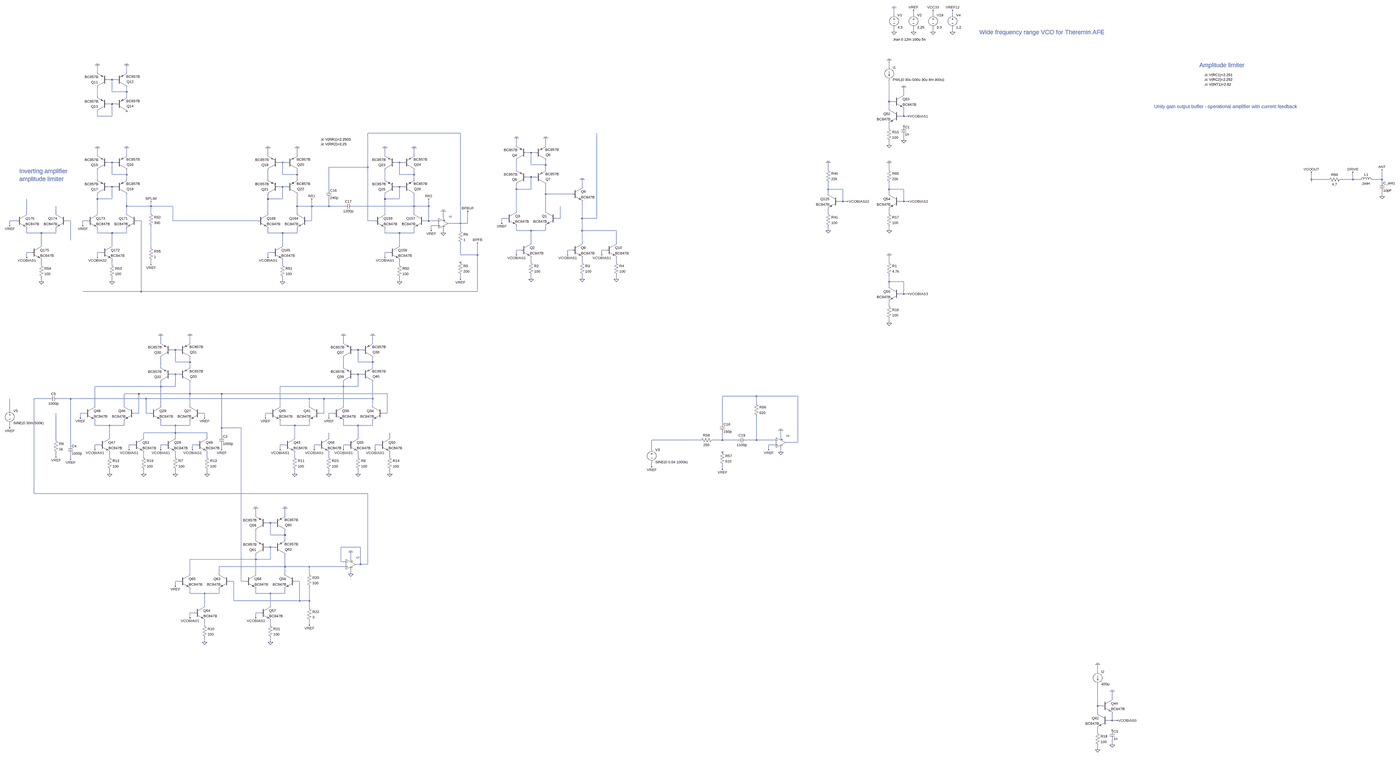
[diagram p0: schematic vco_sine_bjt_v11.asc, whole sheet]
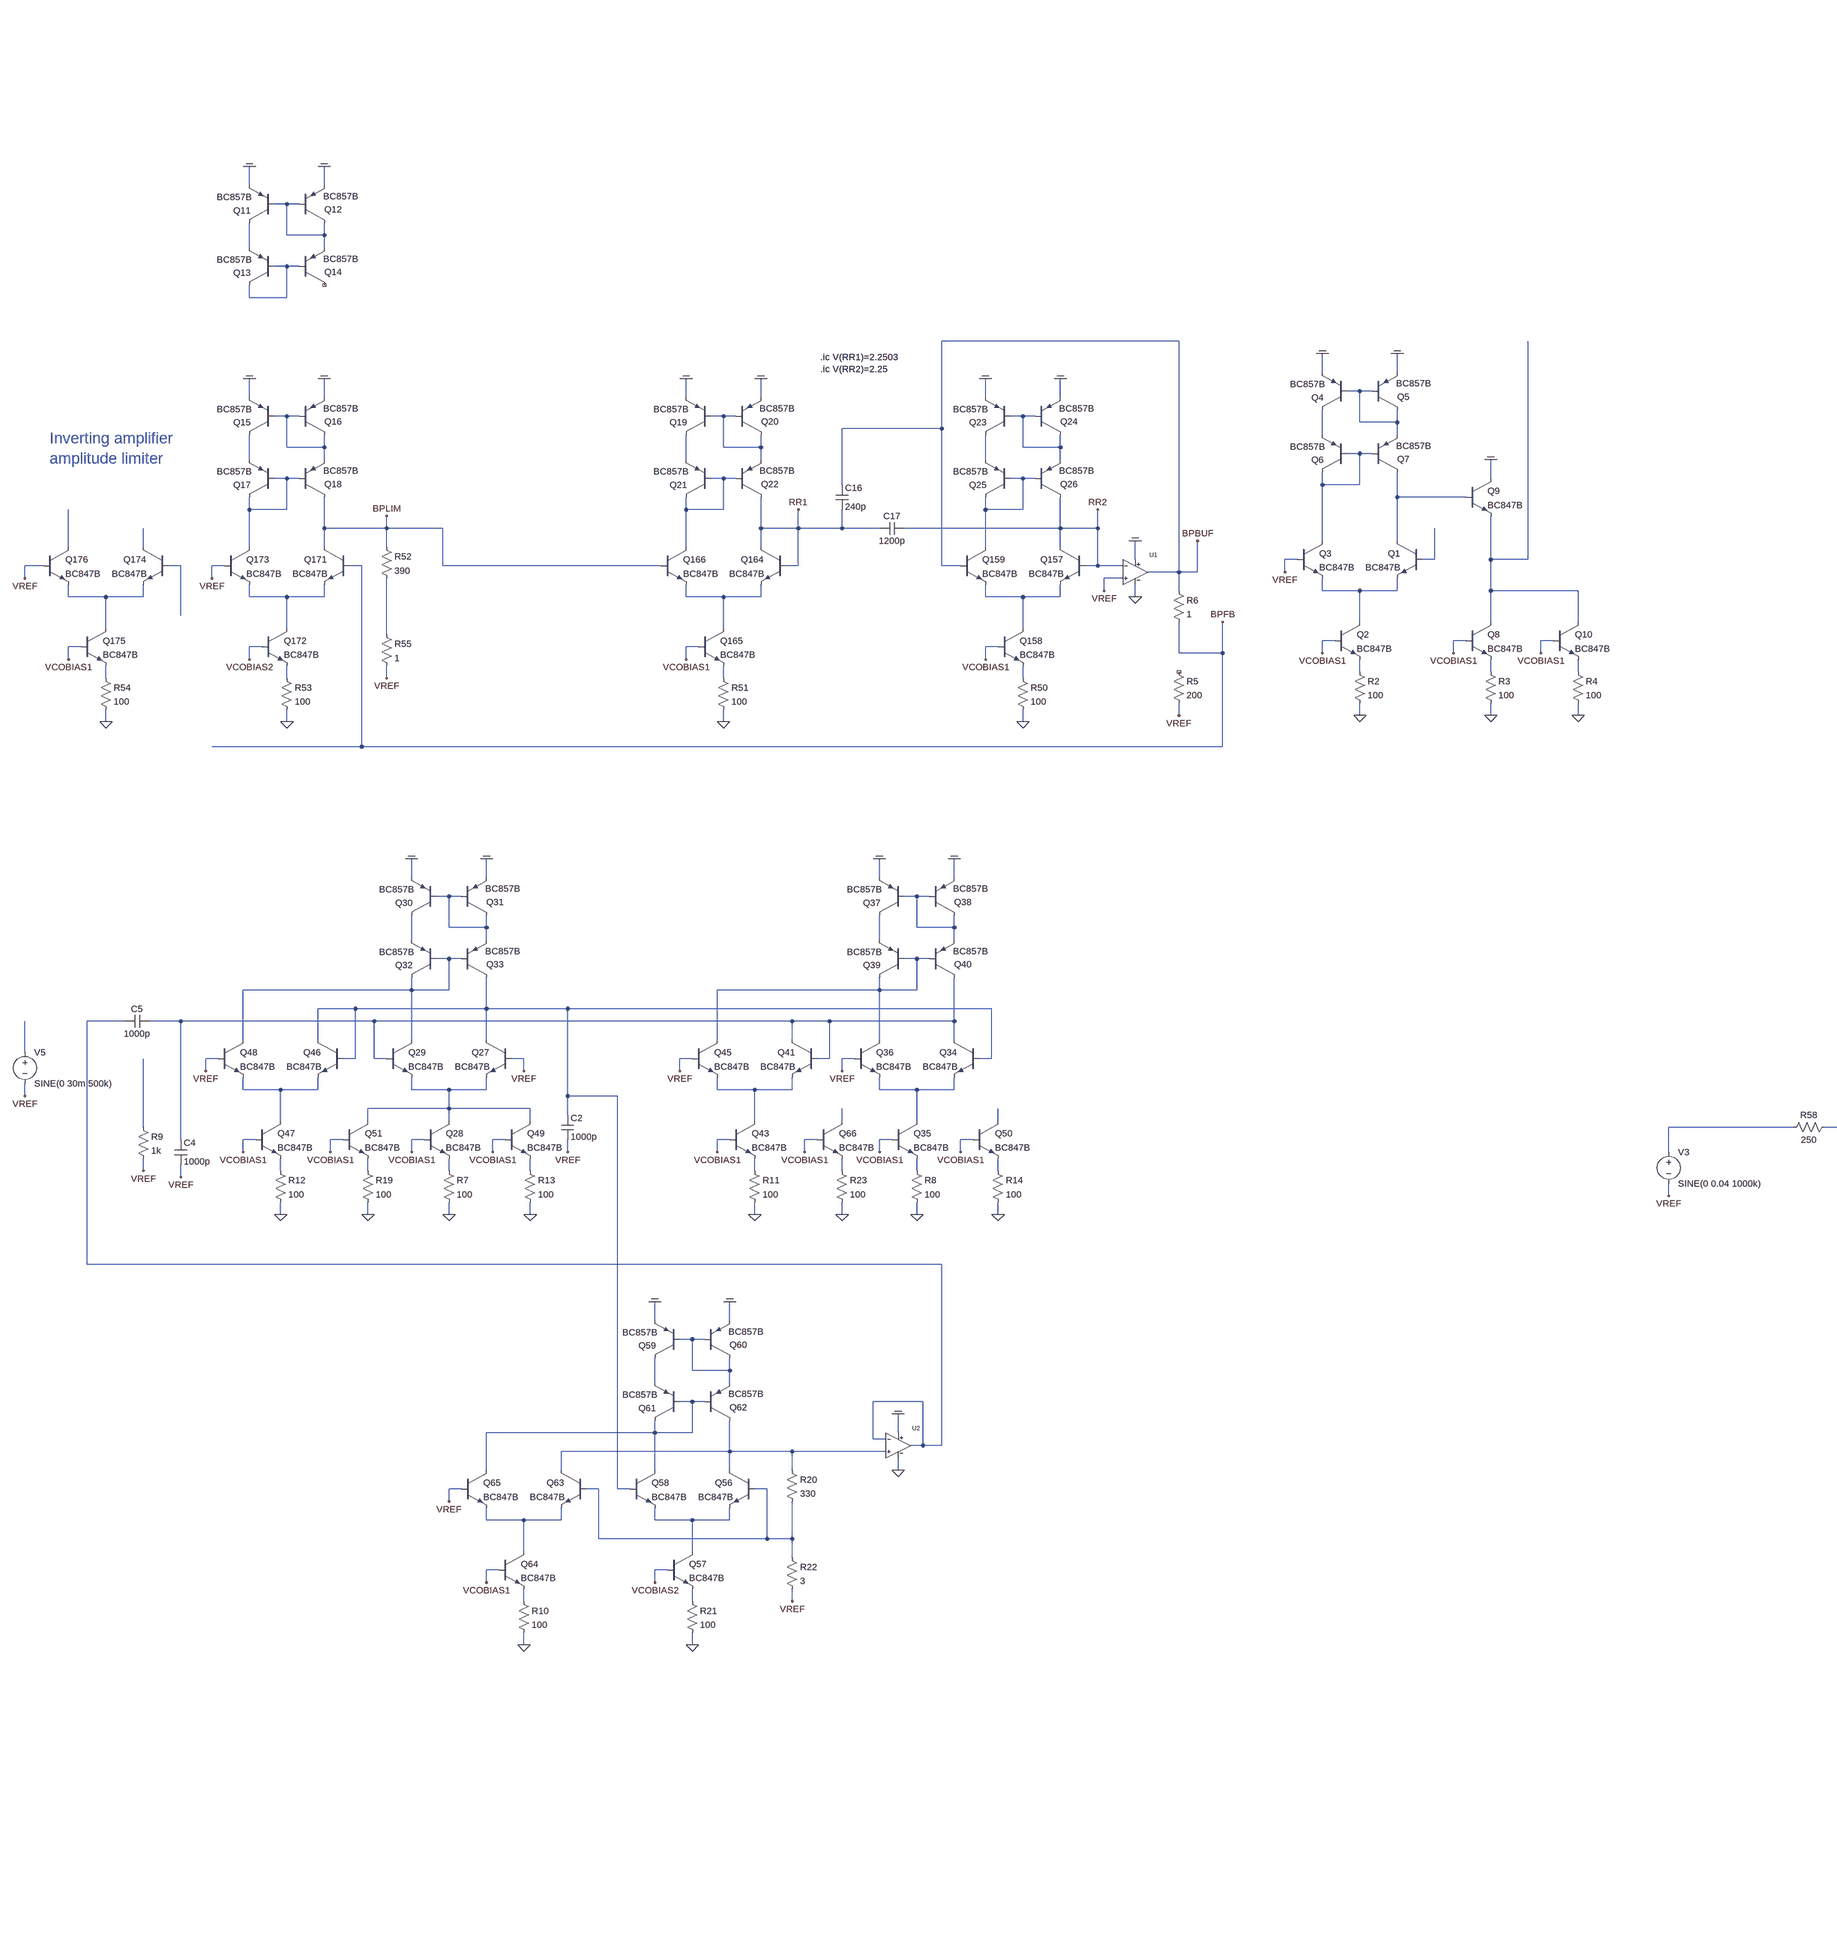
[diagram p1: schematic vco_sine_bjt_v11.asc, part, row 1 of 1, column 1 of 2]
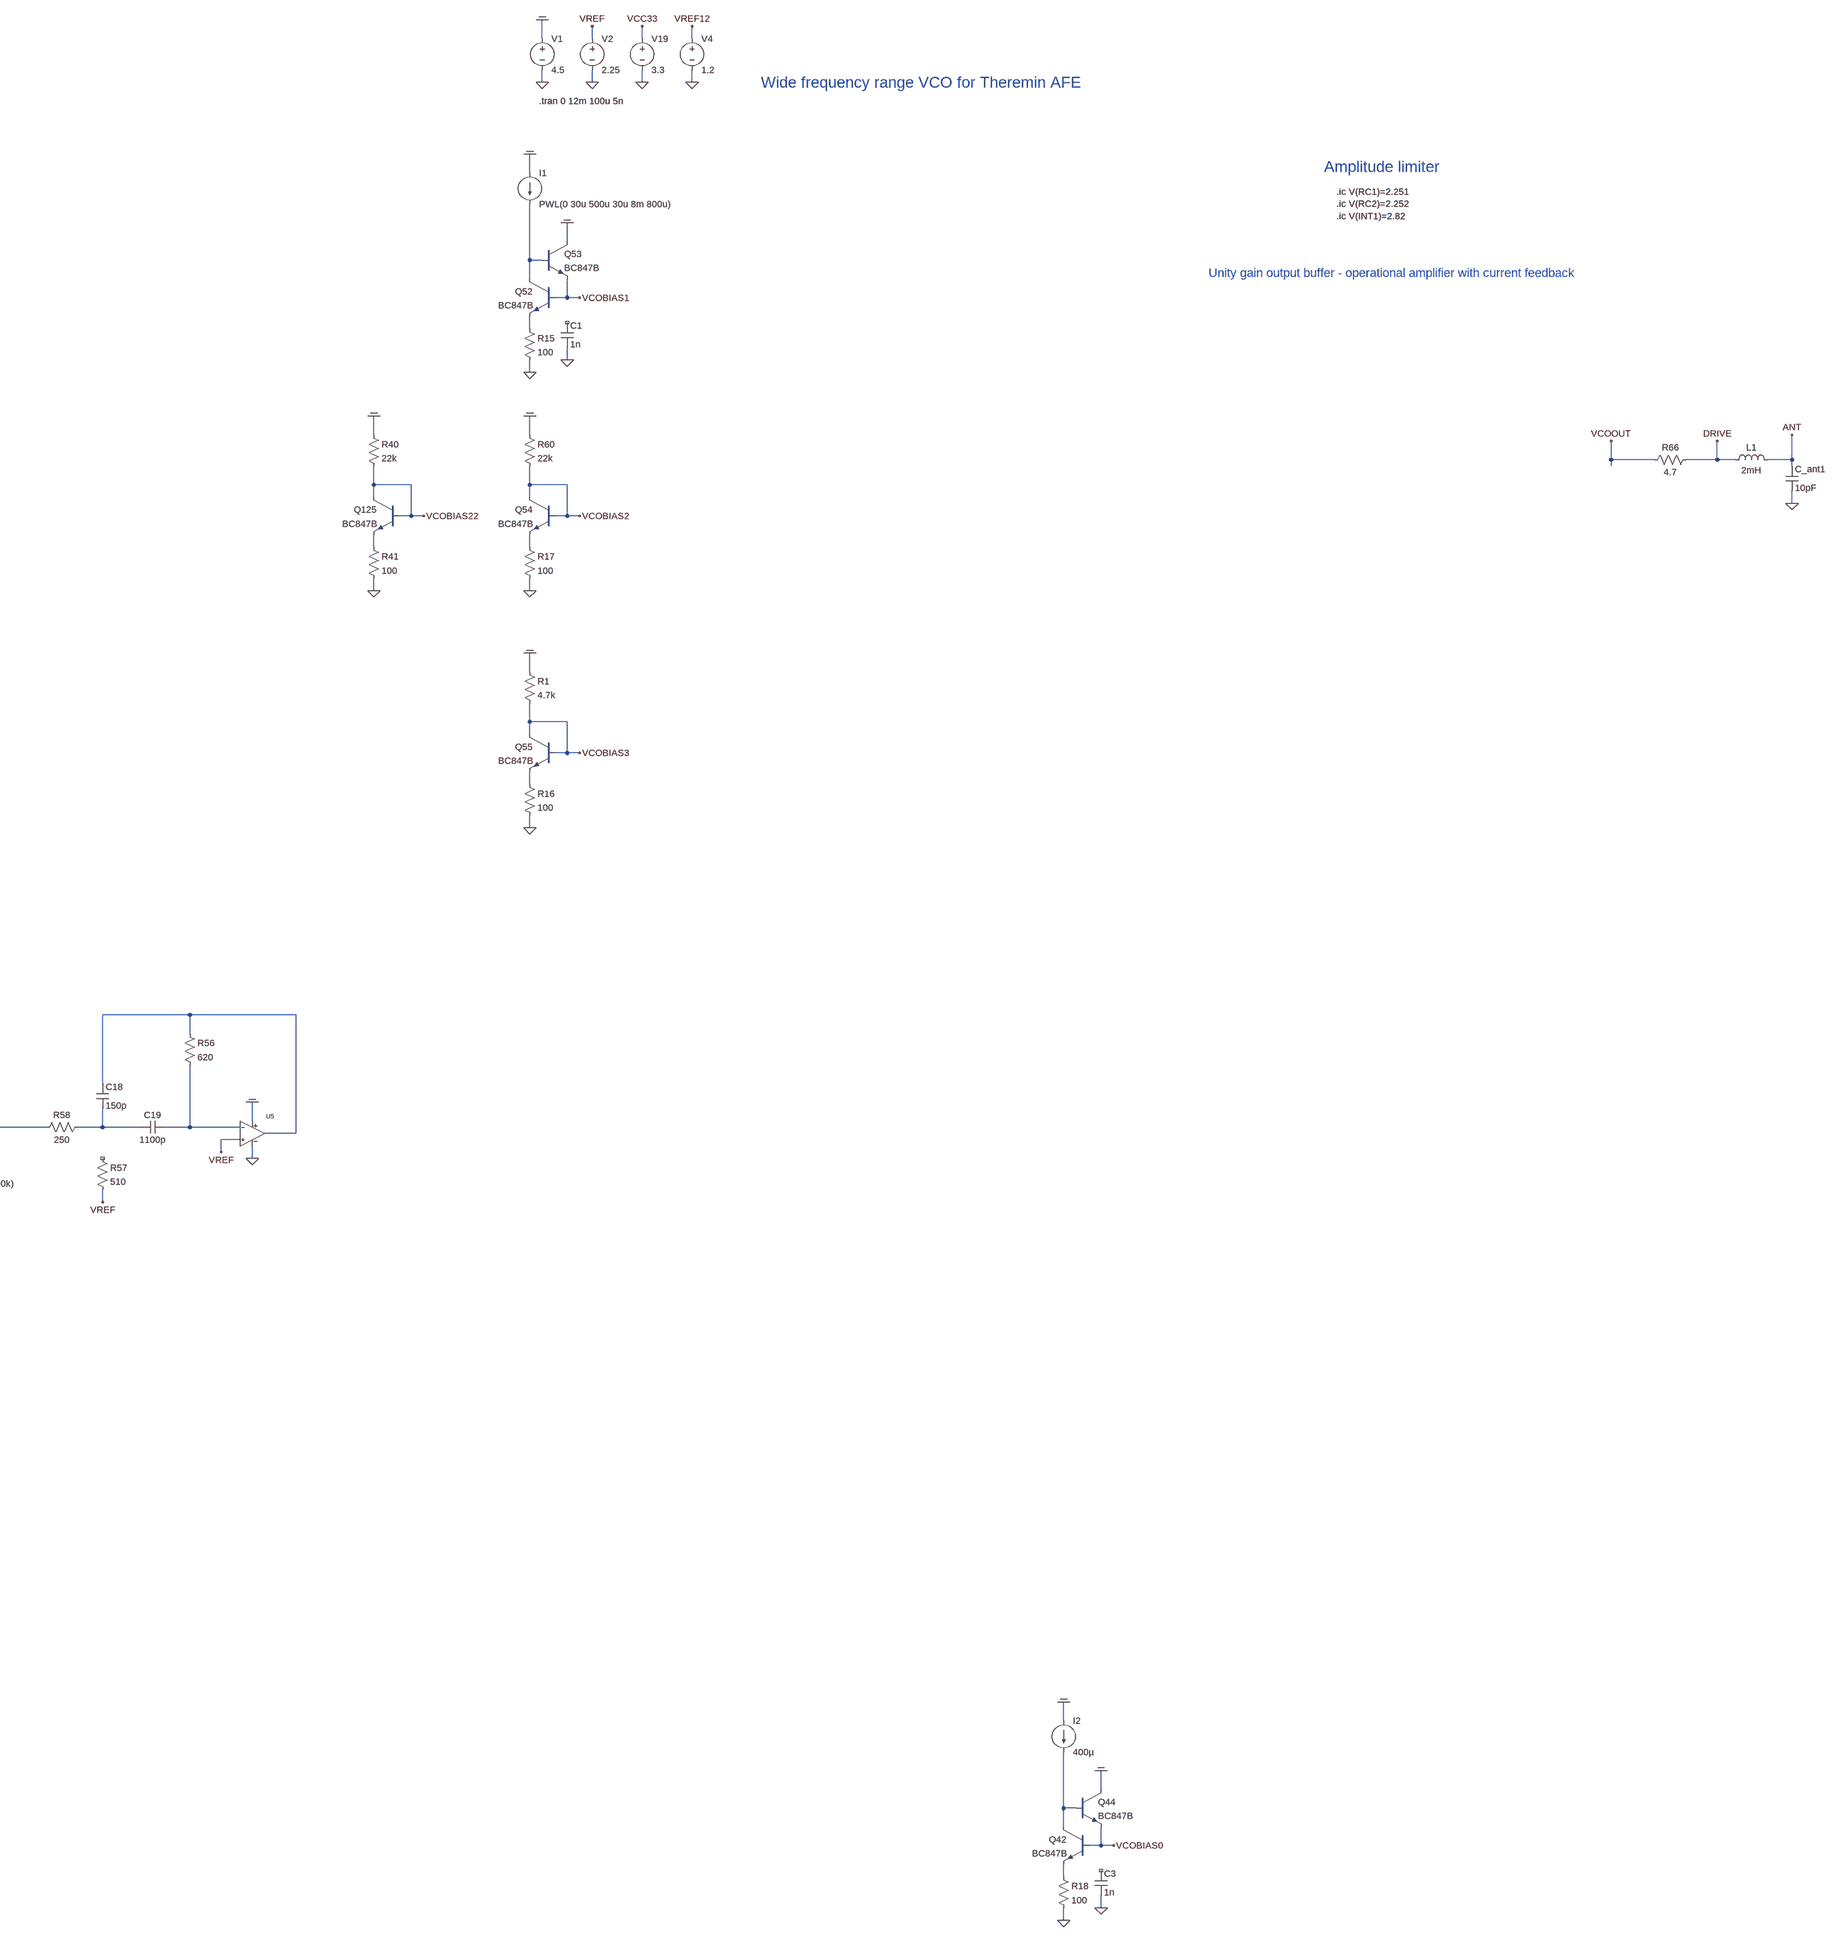
[diagram p2: schematic vco_sine_bjt_v11.asc, part, row 1 of 1, column 2 of 2]
vco_sine_bjt_v11.asc, the LTspice schematic file:
Version 4
SHEET 1 13504 21184
WIRE -432 13600 -432 13552
WIRE -304 13600 -304 13568
WIRE -176 13600 -176 13568
WIRE -48 13600 -48 13568
WIRE -432 13712 -432 13680
WIRE -304 13712 -304 13680
WIRE -176 13712 -176 13680
WIRE -48 13712 -48 13680
WIRE -464 14000 -464 13952
WIRE -6208 14032 -6208 13984
WIRE -6016 14032 -6016 13984
WIRE -6112 14080 -6144 14080
WIRE -6080 14080 -6112 14080
WIRE -6112 14160 -6112 14080
WIRE -6016 14160 -6016 14128
WIRE -6016 14160 -6112 14160
WIRE -368 14176 -368 14128
WIRE -6208 14192 -6208 14128
WIRE -6016 14192 -6016 14160
WIRE -464 14224 -464 14080
WIRE -432 14224 -464 14224
WIRE -6112 14240 -6144 14240
WIRE -6080 14240 -6112 14240
WIRE -464 14272 -464 14224
WIRE -6208 14320 -6208 14288
WIRE -6112 14320 -6112 14240
WIRE -6112 14320 -6208 14320
WIRE -368 14320 -368 14272
WIRE -368 14320 -400 14320
WIRE -336 14320 -368 14320
WIRE -464 14400 -464 14368
WIRE -3824 14432 -4432 14432
WIRE -368 14480 -368 14448
WIRE -3456 14512 -3456 14464
WIRE -3264 14512 -3264 14464
WIRE -464 14512 -464 14480
WIRE -3360 14560 -3392 14560
WIRE -3328 14560 -3360 14560
WIRE -6208 14576 -6208 14528
WIRE -6016 14576 -6016 14528
WIRE -5088 14576 -5088 14528
WIRE -4896 14576 -4896 14528
WIRE -4320 14576 -4320 14528
WIRE -4128 14576 -4128 14528
WIRE -6112 14624 -6144 14624
WIRE -6080 14624 -6112 14624
WIRE -4992 14624 -5024 14624
WIRE -4960 14624 -4992 14624
WIRE -4224 14624 -4256 14624
WIRE -4192 14624 -4224 14624
WIRE -3360 14640 -3360 14560
WIRE -3264 14640 -3264 14608
WIRE -3264 14640 -3360 14640
WIRE -4432 14656 -4432 14432
WIRE -4432 14656 -4688 14656
WIRE -3456 14672 -3456 14608
WIRE -3264 14672 -3264 14640
WIRE -864 14672 -864 14624
WIRE -464 14672 -464 14624
WIRE -6112 14704 -6112 14624
WIRE -6016 14704 -6016 14672
WIRE -6016 14704 -6112 14704
WIRE -4992 14704 -4992 14624
WIRE -4896 14704 -4896 14672
WIRE -4896 14704 -4992 14704
WIRE -4224 14704 -4224 14624
WIRE -4128 14704 -4128 14672
WIRE -4128 14704 -4224 14704
WIRE -3360 14720 -3392 14720
WIRE -3328 14720 -3360 14720
WIRE -6208 14736 -6208 14672
WIRE -6016 14736 -6016 14704
WIRE -5088 14736 -5088 14672
WIRE -4896 14736 -4896 14704
WIRE -4320 14736 -4320 14672
WIRE -4128 14736 -4128 14704
WIRE 3536 14736 3536 14688
WIRE 3648 14736 3536 14736
WIRE 3808 14736 3808 14688
WIRE 3808 14736 3728 14736
WIRE 3856 14736 3808 14736
WIRE 4000 14736 4000 14672
WIRE 4000 14736 3936 14736
WIRE 3536 14752 3536 14736
WIRE 4000 14752 4000 14736
WIRE -6112 14784 -6144 14784
WIRE -6080 14784 -6112 14784
WIRE -4992 14784 -5024 14784
WIRE -4960 14784 -4992 14784
WIRE -4224 14784 -4256 14784
WIRE -4192 14784 -4224 14784
WIRE -3024 14784 -3024 14736
WIRE -4688 14800 -4688 14656
WIRE -3456 14800 -3456 14768
WIRE -3360 14800 -3360 14720
WIRE -3360 14800 -3456 14800
WIRE -864 14800 -864 14752
WIRE -768 14800 -864 14800
WIRE -464 14800 -464 14752
WIRE -368 14800 -464 14800
WIRE -3264 14832 -3264 14768
WIRE -3088 14832 -3264 14832
WIRE -864 14832 -864 14800
WIRE -464 14832 -464 14800
WIRE 4000 14848 4000 14816
WIRE -6208 14864 -6208 14832
WIRE -6112 14864 -6112 14784
WIRE -6112 14864 -6208 14864
WIRE -5088 14864 -5088 14832
WIRE -4992 14864 -4992 14784
WIRE -4992 14864 -5088 14864
WIRE -4320 14864 -4320 14832
WIRE -4224 14864 -4224 14784
WIRE -4224 14864 -4320 14864
WIRE -768 14880 -768 14800
WIRE -768 14880 -800 14880
WIRE -736 14880 -768 14880
WIRE -368 14880 -368 14800
WIRE -368 14880 -400 14880
WIRE -336 14880 -368 14880
WIRE -6016 14912 -6016 14832
WIRE -5856 14912 -5856 14880
WIRE -5856 14912 -6016 14912
WIRE -5712 14912 -5856 14912
WIRE -4896 14912 -4896 14832
WIRE -4800 14912 -4800 14864
WIRE -4800 14912 -4896 14912
WIRE -4688 14912 -4688 14864
WIRE -4688 14912 -4800 14912
WIRE -4592 14912 -4688 14912
WIRE -4128 14912 -4128 14832
WIRE -4128 14912 -4528 14912
WIRE -4032 14912 -4032 14864
WIRE -4032 14912 -4128 14912
WIRE -3456 14944 -3456 14800
WIRE -3264 14944 -3264 14832
WIRE -6672 14960 -6672 14864
WIRE -6480 14960 -6480 14912
WIRE -6208 14960 -6208 14864
WIRE -6016 14960 -6016 14912
WIRE -5856 14960 -5856 14912
WIRE -5088 14960 -5088 14864
WIRE -4896 14960 -4896 14912
WIRE -4320 14960 -4320 14864
WIRE -4128 14960 -4128 14912
WIRE -864 14960 -864 14928
WIRE -464 14960 -464 14928
WIRE -3936 14992 -3936 14944
WIRE -3520 14992 -3552 14992
WIRE -3168 14992 -3168 14912
WIRE -3168 14992 -3200 14992
WIRE -3024 14992 -3024 14880
WIRE -2928 14992 -2928 14432
WIRE -2928 14992 -3024 14992
WIRE -6736 15008 -6784 15008
WIRE -6384 15008 -6416 15008
WIRE -6272 15008 -6304 15008
WIRE -5920 15008 -5952 15008
WIRE -5712 15008 -5712 14912
WIRE -5152 15008 -5712 15008
WIRE -4800 15008 -4800 14912
WIRE -4800 15008 -4832 15008
WIRE -4432 15008 -4432 14656
WIRE -4384 15008 -4432 15008
WIRE -4032 15008 -4032 14912
WIRE -4032 15008 -4064 15008
WIRE -3968 15008 -4032 15008
WIRE -3824 15024 -3824 14432
WIRE -3824 15024 -3904 15024
WIRE -3776 15024 -3776 14944
WIRE -3776 15024 -3824 15024
WIRE -3552 15024 -3552 14992
WIRE -6784 15040 -6784 15008
WIRE -6304 15040 -6304 15008
WIRE -3968 15040 -4016 15040
WIRE -4016 15072 -4016 15040
WIRE -3824 15072 -3824 15024
WIRE -3456 15072 -3456 15040
WIRE -3360 15072 -3456 15072
WIRE -3264 15072 -3264 15040
WIRE -3264 15072 -3360 15072
WIRE -3024 15072 -3024 14992
WIRE -2800 15072 -3024 15072
WIRE -864 15072 -864 15040
WIRE -464 15072 -464 15040
WIRE -6672 15088 -6672 15056
WIRE -6576 15088 -6672 15088
WIRE -6480 15088 -6480 15056
WIRE -6480 15088 -6576 15088
WIRE -6208 15088 -6208 15056
WIRE -6112 15088 -6208 15088
WIRE -6016 15088 -6016 15056
WIRE -6016 15088 -6112 15088
WIRE -5088 15088 -5088 15056
WIRE -4992 15088 -5088 15088
WIRE -4896 15088 -4896 15056
WIRE -4896 15088 -4992 15088
WIRE -4320 15088 -4320 15056
WIRE -4224 15088 -4320 15088
WIRE -4128 15088 -4128 15056
WIRE -4128 15088 -4224 15088
WIRE -3936 15088 -3936 15056
WIRE -6384 15136 -6384 15008
WIRE -3360 15152 -3360 15072
WIRE -3024 15152 -3024 15072
WIRE -2800 15152 -2800 15072
WIRE -6576 15168 -6576 15088
WIRE -6112 15168 -6112 15088
WIRE -4992 15168 -4992 15088
WIRE -4224 15168 -4224 15088
WIRE -5856 15184 -5856 15040
WIRE -3424 15200 -3456 15200
WIRE -3088 15200 -3120 15200
WIRE -2864 15200 -2896 15200
WIRE -6640 15216 -6672 15216
WIRE -6176 15216 -6208 15216
WIRE -5056 15216 -5088 15216
WIRE -4288 15216 -4320 15216
WIRE -3824 15232 -3824 15152
WIRE -3712 15232 -3712 15152
WIRE -3712 15232 -3824 15232
WIRE -3456 15232 -3456 15200
WIRE -3120 15232 -3120 15200
WIRE -2896 15232 -2896 15200
WIRE -6672 15248 -6672 15216
WIRE -6208 15248 -6208 15216
WIRE -5088 15248 -5088 15216
WIRE -4320 15248 -4320 15216
WIRE -3360 15280 -3360 15248
WIRE -3024 15280 -3024 15248
WIRE -2800 15280 -2800 15248
WIRE -464 15280 -464 15232
WIRE -6576 15296 -6576 15264
WIRE -6112 15296 -6112 15264
WIRE -5856 15296 -5856 15264
WIRE -4992 15296 -4992 15264
WIRE -4224 15296 -4224 15264
WIRE -3824 15392 -3824 15360
WIRE -3360 15392 -3360 15360
WIRE -3024 15392 -3024 15360
WIRE -2800 15392 -2800 15360
WIRE -6576 15408 -6576 15376
WIRE -6112 15408 -6112 15376
WIRE -4992 15408 -4992 15376
WIRE -4224 15408 -4224 15376
WIRE -464 15408 -464 15360
WIRE -368 15408 -464 15408
WIRE -464 15440 -464 15408
WIRE -5920 15472 -5920 15008
WIRE -5920 15472 -6304 15472
WIRE -3712 15472 -3712 15232
WIRE -3712 15472 -5920 15472
WIRE -368 15488 -368 15408
WIRE -368 15488 -400 15488
WIRE -336 15488 -368 15488
WIRE -464 15568 -464 15536
WIRE -464 15680 -464 15648
WIRE -5792 15808 -5792 15760
WIRE -5600 15808 -5600 15760
WIRE -4592 15808 -4592 15760
WIRE -4400 15808 -4400 15760
WIRE -5696 15856 -5728 15856
WIRE -5664 15856 -5696 15856
WIRE -4496 15856 -4528 15856
WIRE -4464 15856 -4496 15856
WIRE -5696 15936 -5696 15856
WIRE -5600 15936 -5600 15904
WIRE -5600 15936 -5696 15936
WIRE -4496 15936 -4496 15856
WIRE -4400 15936 -4400 15904
WIRE -4400 15936 -4496 15936
WIRE -5792 15968 -5792 15904
WIRE -5600 15968 -5600 15936
WIRE -4592 15968 -4592 15904
WIRE -4400 15968 -4400 15936
WIRE -5696 16016 -5728 16016
WIRE -5664 16016 -5696 16016
WIRE -4496 16016 -4528 16016
WIRE -4464 16016 -4496 16016
WIRE -5792 16096 -5792 16064
WIRE -5792 16096 -6224 16096
WIRE -5696 16096 -5696 16016
WIRE -5696 16096 -5792 16096
WIRE -4592 16096 -4592 16064
WIRE -4592 16096 -5008 16096
WIRE -4496 16096 -4496 16016
WIRE -4496 16096 -4592 16096
WIRE -5936 16144 -6032 16144
WIRE -5600 16144 -5600 16064
WIRE -5600 16144 -5936 16144
WIRE -5392 16144 -5600 16144
WIRE -4304 16144 -5392 16144
WIRE -1776 16160 -2000 16160
WIRE -1504 16160 -1776 16160
WIRE -6528 16176 -6624 16176
WIRE -6384 16176 -6464 16176
WIRE -5888 16176 -6384 16176
WIRE -4816 16176 -5888 16176
WIRE -4720 16176 -4816 16176
WIRE -4400 16176 -4400 16064
WIRE -4400 16176 -4720 16176
WIRE -1776 16208 -1776 16160
WIRE -6224 16224 -6224 16096
WIRE -6032 16224 -6032 16144
WIRE -5792 16224 -5792 16096
WIRE -5600 16224 -5600 16144
WIRE -5008 16224 -5008 16096
WIRE -4816 16224 -4816 16176
WIRE -4592 16224 -4592 16096
WIRE -4400 16224 -4400 16176
WIRE -6784 16256 -6784 16176
WIRE -6288 16272 -6320 16272
WIRE -5936 16272 -5936 16144
WIRE -5936 16272 -5968 16272
WIRE -5888 16272 -5888 16176
WIRE -5856 16272 -5888 16272
WIRE -5504 16272 -5536 16272
WIRE -5072 16272 -5104 16272
WIRE -4720 16272 -4720 16176
WIRE -4720 16272 -4752 16272
WIRE -4656 16272 -4688 16272
WIRE -4304 16272 -4304 16144
WIRE -4304 16272 -4336 16272
WIRE -6320 16304 -6320 16272
WIRE -5504 16304 -5504 16272
WIRE -5104 16304 -5104 16272
WIRE -4688 16304 -4688 16272
WIRE -2000 16336 -2000 16160
WIRE -6224 16352 -6224 16320
WIRE -6128 16352 -6224 16352
WIRE -6032 16352 -6032 16320
WIRE -6032 16352 -6128 16352
WIRE -5792 16352 -5792 16320
WIRE -5696 16352 -5792 16352
WIRE -5600 16352 -5600 16320
WIRE -5600 16352 -5696 16352
WIRE -5008 16352 -5008 16320
WIRE -4912 16352 -5008 16352
WIRE -4816 16352 -4816 16320
WIRE -4816 16352 -4912 16352
WIRE -4592 16352 -4592 16320
WIRE -4496 16352 -4592 16352
WIRE -4400 16352 -4400 16320
WIRE -4400 16352 -4496 16352
WIRE -6784 16368 -6784 16336
WIRE -5392 16368 -5392 16144
WIRE -5264 16368 -5392 16368
WIRE -5696 16400 -5696 16352
WIRE -5696 16400 -5904 16400
WIRE -5488 16400 -5696 16400
WIRE -4496 16432 -4496 16352
WIRE -5392 16416 -5392 16368
WIRE -6128 16432 -6128 16352
WIRE -5904 16432 -5904 16400
WIRE -5696 16432 -5696 16400
WIRE -5488 16432 -5488 16400
WIRE -4912 16432 -4912 16352
WIRE -4688 16432 -4688 16400
WIRE -4288 16432 -4288 16400
WIRE -1616 16432 -1616 16384
WIRE -6480 16448 -6480 16272
WIRE -2144 16448 -2464 16448
WIRE -2000 16448 -2000 16400
WIRE -2000 16448 -2064 16448
WIRE -1904 16448 -2000 16448
WIRE -1776 16448 -1776 16288
WIRE -1776 16448 -1840 16448
WIRE -1648 16448 -1776 16448
WIRE -1504 16464 -1504 16160
WIRE -1504 16464 -1584 16464
WIRE -6384 16480 -6384 16176
WIRE -6192 16480 -6224 16480
WIRE -5968 16480 -6000 16480
WIRE -5760 16480 -5792 16480
WIRE -5552 16480 -5584 16480
WIRE -4976 16480 -5008 16480
WIRE -4752 16480 -4784 16480
WIRE -4560 16480 -4592 16480
WIRE -4352 16480 -4384 16480
WIRE -1648 16480 -1696 16480
WIRE -6224 16512 -6224 16480
WIRE -6000 16512 -6000 16480
WIRE -5792 16512 -5792 16480
WIRE -5584 16512 -5584 16480
WIRE -5392 16512 -5392 16480
WIRE -5008 16512 -5008 16480
WIRE -4784 16512 -4784 16480
WIRE -4592 16512 -4592 16480
WIRE -4384 16512 -4384 16480
WIRE -2464 16512 -2464 16448
WIRE -1696 16512 -1696 16480
WIRE -1616 16528 -1616 16496
WIRE -6480 16560 -6480 16528
WIRE -6128 16560 -6128 16528
WIRE -5904 16560 -5904 16528
WIRE -5696 16560 -5696 16528
WIRE -5488 16560 -5488 16528
WIRE -4912 16560 -4912 16528
WIRE -4688 16560 -4688 16528
WIRE -4496 16560 -4496 16528
WIRE -4288 16560 -4288 16528
WIRE -6384 16576 -6384 16544
WIRE -2464 16624 -2464 16592
WIRE -2000 16640 -2000 16608
WIRE -6128 16672 -6128 16640
WIRE -5904 16672 -5904 16640
WIRE -5696 16672 -5696 16640
WIRE -5488 16672 -5488 16640
WIRE -4912 16672 -4912 16640
WIRE -4688 16672 -4688 16640
WIRE -4496 16672 -4496 16640
WIRE -4288 16672 -4288 16640
WIRE -6624 16800 -6624 16176
WIRE -4432 16800 -6624 16800
WIRE -5168 16944 -5168 16896
WIRE -4976 16944 -4976 16896
WIRE -5072 16992 -5104 16992
WIRE -5040 16992 -5072 16992
WIRE -5072 17072 -5072 16992
WIRE -4976 17072 -4976 17040
WIRE -4976 17072 -5072 17072
WIRE -5168 17104 -5168 17040
WIRE -4976 17104 -4976 17072
WIRE -5072 17152 -5104 17152
WIRE -5040 17152 -5072 17152
WIRE -4480 17152 -4608 17152
WIRE -5168 17232 -5168 17200
WIRE -5168 17232 -5600 17232
WIRE -5072 17232 -5072 17152
WIRE -5072 17232 -5168 17232
WIRE -4544 17232 -4544 17184
WIRE -4608 17248 -4608 17152
WIRE -4576 17248 -4608 17248
WIRE -4480 17264 -4480 17152
WIRE -4480 17264 -4512 17264
WIRE -4432 17264 -4432 16800
WIRE -4432 17264 -4480 17264
WIRE -4976 17280 -4976 17200
WIRE -4976 17280 -5408 17280
WIRE -4816 17280 -4976 17280
WIRE -4576 17280 -4816 17280
WIRE -5600 17328 -5600 17232
WIRE -5408 17328 -5408 17280
WIRE -5168 17328 -5168 17232
WIRE -4976 17328 -4976 17280
WIRE -4816 17328 -4816 17280
WIRE -4544 17328 -4544 17296
WIRE -5664 17376 -5696 17376
WIRE -5312 17376 -5344 17376
WIRE -5264 17376 -5264 16368
WIRE -5232 17376 -5264 17376
WIRE -4880 17376 -4912 17376
WIRE -5696 17408 -5696 17376
WIRE -5600 17456 -5600 17424
WIRE -5504 17456 -5600 17456
WIRE -5408 17456 -5408 17424
WIRE -5408 17456 -5504 17456
WIRE -5168 17456 -5168 17424
WIRE -5072 17456 -5168 17456
WIRE -4976 17456 -4976 17424
WIRE -4976 17456 -5072 17456
WIRE -5312 17504 -5312 17376
WIRE -4880 17504 -4880 17376
WIRE -4880 17504 -5312 17504
WIRE -4816 17504 -4816 17408
WIRE -4816 17504 -4880 17504
WIRE -5504 17536 -5504 17456
WIRE -5072 17536 -5072 17456
WIRE -4816 17552 -4816 17504
WIRE -5568 17584 -5600 17584
WIRE -5136 17584 -5168 17584
WIRE -5600 17616 -5600 17584
WIRE -5168 17616 -5168 17584
WIRE -5504 17664 -5504 17632
WIRE -5072 17664 -5072 17632
WIRE -4816 17664 -4816 17632
WIRE -5504 17776 -5504 17744
WIRE -5072 17776 -5072 17744
WIRE 1184 18336 1184 18288
WIRE 1280 18512 1280 18464
WIRE 1184 18560 1184 18416
WIRE 1216 18560 1184 18560
WIRE 1184 18608 1184 18560
WIRE 1280 18656 1280 18608
WIRE 1280 18656 1248 18656
WIRE 1312 18656 1280 18656
WIRE 1184 18736 1184 18704
WIRE 1280 18816 1280 18784
WIRE 1184 18848 1184 18816
FLAG -432 13712 0
FLAG -432 13552 COM
FLAG -304 13712 0
FLAG -304 13568 VREF
FLAG -176 13712 0
FLAG -176 13568 VCC33
FLAG -48 13712 0
FLAG -48 13568 VREF12
FLAG -336 14320 VCOBIAS1
FLAG -464 14624 COM
FLAG -464 15232 COM
FLAG -464 13952 COM
FLAG -336 14880 VCOBIAS2
FLAG -336 15488 VCOBIAS3
FLAG -368 14128 COM
FLAG -464 14512 0
FLAG -464 15680 0
FLAG -464 15072 0
FLAG -368 14480 0
FLAG -864 14624 COM
FLAG -736 14880 VCOBIAS22
FLAG -864 15072 0
FLAG 4000 14848 0
FLAG 4000 14672 ANT
FLAG 3808 14688 DRIVE
FLAG 3536 14688 VCOOUT
FLAG 1312 18656 VCOBIAS0
FLAG 1184 18288 COM
FLAG 1280 18464 COM
FLAG 1184 18848 0
FLAG 1280 18816 0
FLAG -4800 14864 RR1
FLAG -4320 15248 VCOBIAS1
FLAG -4224 15408 0
FLAG -4032 14864 RR2
FLAG -5088 15248 VCOBIAS1
FLAG -4992 15408 0
FLAG -6208 15248 VCOBIAS2
FLAG -5856 15296 VREF
FLAG -5856 14880 BPLIM
FLAG -6112 15408 0
FLAG -6672 15248 VCOBIAS1
FLAG -6576 15408 0
FLAG -6784 15040 VREF
FLAG -6304 15040 VREF
FLAG -3776 14944 BPBUF
FLAG -1616 16528 0
FLAG -1616 16384 COM
FLAG -2464 16624 VREF
FLAG -2000 16640 VREF
FLAG -1696 16512 VREF
FLAG -3552 15024 VREF
FLAG -3456 15232 VCOBIAS1
FLAG -3360 15392 0
FLAG -3456 14464 COM
FLAG -3264 14464 COM
FLAG -3120 15232 VCOBIAS1
FLAG -3024 15392 0
FLAG -3024 14736 COM
FLAG -2896 15232 VCOBIAS1
FLAG -2800 15392 0
FLAG -3936 15088 0
FLAG -3936 14944 COM
FLAG -4016 15072 VREF
FLAG -3712 15152 BPFB
FLAG -3824 15392 VREF
FLAG -6208 13984 COM
FLAG -6016 13984 COM
FLAG -6208 14528 COM
FLAG -6016 14528 COM
FLAG -5088 14528 COM
FLAG -4896 14528 COM
FLAG -4320 14528 COM
FLAG -4128 14528 COM
FLAG -5792 16512 VCOBIAS1
FLAG -5696 16672 0
FLAG -5792 15760 COM
FLAG -5600 15760 COM
FLAG -5504 16304 VREF
FLAG -4592 16512 VCOBIAS1
FLAG -4496 16672 0
FLAG -4592 15760 COM
FLAG -4400 15760 COM
FLAG -5392 16512 VREF
FLAG -6384 16576 VREF
FLAG -6784 16368 VREF
FLAG -6480 16560 VREF
FLAG -5008 16512 VCOBIAS1
FLAG -4912 16672 0
FLAG -5104 16304 VREF
FLAG -4688 16304 VREF
FLAG -6224 16512 VCOBIAS1
FLAG -6128 16672 0
FLAG -6320 16304 VREF
FLAG -5584 16512 VCOBIAS1
FLAG -5488 16672 0
FLAG -4384 16512 VCOBIAS1
FLAG -4288 16672 0
FLAG -6000 16512 VCOBIAS1
FLAG -5904 16672 0
FLAG -5168 17616 VCOBIAS2
FLAG -4816 17664 VREF
FLAG -5072 17776 0
FLAG -5168 16896 COM
FLAG -4976 16896 COM
FLAG -4544 17328 0
FLAG -4544 17184 COM
FLAG -5600 17616 VCOBIAS1
FLAG -5504 17776 0
FLAG -5696 17408 VREF
FLAG -4784 16512 VCOBIAS1
FLAG -4688 16672 0
SYMBOL voltage -432 13584 R0
SYMATTR InstName V1
SYMATTR Value 4.5
SYMBOL Voltage -304 13584 R0
SYMATTR InstName V2
SYMATTR Value 2.25
SYMBOL Voltage -176 13584 R0
SYMATTR InstName V19
SYMATTR Value 3.3
SYMBOL Voltage -48 13584 R0
SYMATTR InstName V4
SYMATTR Value 1.2
SYMBOL npn -400 14272 M0
SYMATTR InstName Q52
SYMATTR Value BC847B
SYMBOL Res -480 14656 R0
SYMATTR InstName R60
SYMATTR Value 22k
SYMBOL Res -480 15264 R0
SYMATTR InstName R1
SYMATTR Value 4.7k
SYMBOL current -464 14000 R0
SYMATTR InstName I1
SYMATTR Value PWL(0 30u 500u 30u 8m 800u)
SYMBOL npn -400 14832 M0
SYMATTR InstName Q54
SYMATTR Value BC847B
SYMBOL npn -400 15440 M0
SYMATTR InstName Q55
SYMATTR Value BC847B
SYMBOL npn -432 14176 R0
SYMATTR InstName Q53
SYMATTR Value BC847B
SYMBOL Res -480 14384 R0
SYMATTR InstName R15
SYMATTR Value 100
SYMBOL Res -480 15552 R0
SYMATTR InstName R16
SYMATTR Value 100
SYMBOL Res -480 14944 R0
SYMATTR InstName R17
SYMATTR Value 100
SYMBOL Cap -384 14384 R0
SYMATTR InstName C1
SYMATTR Value 1n
SYMBOL Res -880 14656 R0
SYMATTR InstName R40
SYMATTR Value 22k
SYMBOL npn -800 14832 M0
SYMATTR InstName Q125
SYMATTR Value BC847B
SYMBOL Res -880 14944 R0
SYMATTR InstName R41
SYMATTR Value 100
SYMBOL ind 3840 14752 R270
WINDOW 0 32 56 VTop 2
WINDOW 3 5 56 VBottom 2
SYMATTR InstName L1
SYMATTR Value 2mH
SYMATTR SpiceLine Rser=120 Cpar=1pF
SYMBOL Cap 3984 14752 R0
SYMATTR InstName C_ant1
SYMATTR Value 10pF
SYMBOL Res 3632 14752 R270
WINDOW 0 32 56 VTop 2
WINDOW 3 0 56 VBottom 2
SYMATTR InstName R66
SYMATTR Value 4.7
SYMBOL npn 1248 18608 M0
SYMATTR InstName Q42
SYMATTR Value BC847B
SYMBOL current 1184 18336 R0
SYMATTR InstName I2
SYMATTR Value 400µ
SYMBOL npn 1216 18512 R0
SYMATTR InstName Q44
SYMATTR Value BC847B
SYMBOL Res 1168 18720 R0
SYMATTR InstName R18
SYMATTR Value 100
SYMBOL Cap 1264 18720 R0
SYMATTR InstName C3
SYMATTR Value 1n
SYMBOL npn -4064 14960 M0
SYMATTR InstName Q157
SYMATTR Value BC847B
SYMBOL npn -4288 15168 R0
SYMATTR InstName Q158
SYMATTR Value BC847B
SYMBOL npn -4384 14960 R0
SYMATTR InstName Q159
SYMATTR Value BC847B
SYMBOL Res -4240 15280 R0
SYMATTR InstName R50
SYMATTR Value 100
SYMBOL npn -4832 14960 M0
SYMATTR InstName Q164
SYMATTR Value BC847B
SYMBOL npn -5056 15168 R0
SYMATTR InstName Q165
SYMATTR Value BC847B
SYMBOL npn -5152 14960 R0
SYMATTR InstName Q166
SYMATTR Value BC847B
SYMBOL Res -5008 15280 R0
SYMATTR InstName R51
SYMATTR Value 100
SYMBOL Cap -4704 14800 R0
SYMATTR InstName C16
SYMATTR Value 240p
SYMBOL Cap -4528 14896 R90
WINDOW 0 0 32 VBottom 2
WINDOW 3 32 32 VTop 2
SYMATTR InstName C17
SYMATTR Value 1200p
SYMBOL npn -5952 14960 M0
SYMATTR InstName Q171
SYMATTR Value BC847B
SYMBOL npn -6176 15168 R0
SYMATTR InstName Q172
SYMATTR Value BC847B
SYMBOL npn -6272 14960 R0
SYMATTR InstName Q173
SYMATTR Value BC847B
SYMBOL Res -5872 14944 R0
SYMATTR InstName R52
SYMATTR Value 390
SYMBOL Res -6128 15280 R0
SYMATTR InstName R53
SYMATTR Value 100
SYMBOL npn -6416 14960 M0
SYMATTR InstName Q174
SYMATTR Value BC847B
SYMBOL npn -6640 15168 R0
SYMATTR InstName Q175
SYMATTR Value BC847B
SYMBOL npn -6736 14960 R0
SYMATTR InstName Q176
SYMATTR Value BC847B
SYMBOL Res -6592 15280 R0
SYMATTR InstName R54
SYMATTR Value 100
SYMBOL Res -5872 15168 R0
SYMATTR InstName R55
SYMATTR Value 1
SYMBOL MCP6021 -1616 16464 R0
SYMATTR InstName U5
SYMBOL Cap -2016 16336 R0
SYMATTR InstName C18
SYMATTR Value 150p
SYMBOL Cap -1840 16432 R90
WINDOW 0 0 32 VBottom 2
WINDOW 3 32 32 VTop 2
SYMATTR InstName C19
SYMATTR Value 1100p
SYMBOL Res -1792 16192 R0
SYMATTR InstName R56
SYMATTR Value 620
SYMBOL Res -2016 16512 R0
SYMATTR InstName R57
SYMATTR Value 510
SYMBOL Res -2048 16432 R90
WINDOW 0 0 56 VBottom 2
WINDOW 3 32 56 VTop 2
SYMATTR InstName R58
SYMATTR Value 250
SYMBOL Voltage -2464 16496 R0
SYMATTR InstName V3
SYMATTR Value SINE(0 0.04 1000k)
SYMBOL npn -3200 14944 M0
SYMATTR InstName Q1
SYMATTR Value BC847B
SYMBOL npn -3424 15152 R0
SYMATTR InstName Q2
SYMATTR Value BC847B
SYMBOL npn -3520 14944 R0
SYMATTR InstName Q3
SYMATTR Value BC847B
SYMBOL Res -3376 15264 R0
SYMATTR InstName R2
SYMATTR Value 100
SYMBOL pnp -3392 14608 R180
WINDOW 0 60 32 Left 2
WINDOW 3 58 66 Left 2
SYMATTR InstName Q4
SYMATTR Value BC857B
SYMBOL pnp -3328 14608 M180
WINDOW 0 64 34 Left 2
WINDOW 3 61 68 Left 2
SYMATTR InstName Q5
SYMATTR Value BC857B
SYMBOL pnp -3392 14768 R180
WINDOW 0 60 32 Left 2
WINDOW 3 58 66 Left 2
SYMATTR InstName Q6
SYMATTR Value BC857B
SYMBOL pnp -3328 14768 M180
WINDOW 0 64 34 Left 2
WINDOW 3 61 68 Left 2
SYMATTR InstName Q7
SYMATTR Value BC857B
SYMBOL npn -3088 15152 R0
SYMATTR InstName Q8
SYMATTR Value BC847B
SYMBOL Res -3040 15264 R0
SYMATTR InstName R3
SYMATTR Value 100
SYMBOL npn -3088 14784 R0
SYMATTR InstName Q9
SYMATTR Value BC847B
SYMBOL npn -2864 15152 R0
SYMATTR InstName Q10
SYMATTR Value BC847B
SYMBOL Res -2816 15264 R0
SYMATTR InstName R4
SYMATTR Value 100
SYMBOL MCP6021 -3936 15024 R0
SYMATTR InstName U1
SYMBOL Res -3840 15264 R0
SYMATTR InstName R5
SYMATTR Value 200
SYMBOL Res -3840 15056 R0
SYMATTR InstName R6
SYMATTR Value 1
SYMBOL pnp -6144 14128 R180
WINDOW 0 60 32 Left 2
WINDOW 3 58 66 Left 2
SYMATTR InstName Q11
SYMATTR Value BC857B
SYMBOL pnp -6080 14128 M180
WINDOW 0 64 34 Left 2
WINDOW 3 61 68 Left 2
SYMATTR InstName Q12
SYMATTR Value BC857B
SYMBOL pnp -6144 14288 R180
WINDOW 0 60 32 Left 2
WINDOW 3 58 66 Left 2
SYMATTR InstName Q13
SYMATTR Value BC857B
SYMBOL pnp -6080 14288 M180
WINDOW 0 64 34 Left 2
WINDOW 3 61 68 Left 2
SYMATTR InstName Q14
SYMATTR Value BC857B
SYMBOL pnp -6144 14672 R180
WINDOW 0 60 32 Left 2
WINDOW 3 58 66 Left 2
SYMATTR InstName Q15
SYMATTR Value BC857B
SYMBOL pnp -6080 14672 M180
WINDOW 0 64 34 Left 2
WINDOW 3 61 68 Left 2
SYMATTR InstName Q16
SYMATTR Value BC857B
SYMBOL pnp -6144 14832 R180
WINDOW 0 60 32 Left 2
WINDOW 3 58 66 Left 2
SYMATTR InstName Q17
SYMATTR Value BC857B
SYMBOL pnp -6080 14832 M180
WINDOW 0 64 34 Left 2
WINDOW 3 61 68 Left 2
SYMATTR InstName Q18
SYMATTR Value BC857B
SYMBOL pnp -5024 14672 R180
WINDOW 0 60 32 Left 2
WINDOW 3 58 66 Left 2
SYMATTR InstName Q19
SYMATTR Value BC857B
SYMBOL pnp -4960 14672 M180
WINDOW 0 64 34 Left 2
WINDOW 3 61 68 Left 2
SYMATTR InstName Q20
SYMATTR Value BC857B
SYMBOL pnp -5024 14832 R180
WINDOW 0 60 32 Left 2
WINDOW 3 58 66 Left 2
SYMATTR InstName Q21
SYMATTR Value BC857B
SYMBOL pnp -4960 14832 M180
WINDOW 0 64 34 Left 2
WINDOW 3 61 68 Left 2
SYMATTR InstName Q22
SYMATTR Value BC857B
SYMBOL pnp -4256 14672 R180
WINDOW 0 60 32 Left 2
WINDOW 3 58 66 Left 2
SYMATTR InstName Q23
SYMATTR Value BC857B
SYMBOL pnp -4192 14672 M180
WINDOW 0 64 34 Left 2
WINDOW 3 61 68 Left 2
SYMATTR InstName Q24
SYMATTR Value BC857B
SYMBOL pnp -4256 14832 R180
WINDOW 0 60 32 Left 2
WINDOW 3 58 66 Left 2
SYMATTR InstName Q25
SYMATTR Value BC857B
SYMBOL pnp -4192 14832 M180
WINDOW 0 64 34 Left 2
WINDOW 3 61 68 Left 2
SYMATTR InstName Q26
SYMATTR Value BC857B
SYMBOL npn -5536 16224 M0
SYMATTR InstName Q27
SYMATTR Value BC847B
SYMBOL npn -5760 16432 R0
SYMATTR InstName Q28
SYMATTR Value BC847B
SYMBOL npn -5856 16224 R0
SYMATTR InstName Q29
SYMATTR Value BC847B
SYMBOL Res -5712 16544 R0
SYMATTR InstName R7
SYMATTR Value 100
SYMBOL pnp -5728 15904 R180
WINDOW 0 60 32 Left 2
WINDOW 3 58 66 Left 2
SYMATTR InstName Q30
SYMATTR Value BC857B
SYMBOL pnp -5664 15904 M180
WINDOW 0 64 34 Left 2
WINDOW 3 61 68 Left 2
SYMATTR InstName Q31
SYMATTR Value BC857B
SYMBOL pnp -5728 16064 R180
WINDOW 0 60 32 Left 2
WINDOW 3 58 66 Left 2
SYMATTR InstName Q32
SYMATTR Value BC857B
SYMBOL pnp -5664 16064 M180
WINDOW 0 64 34 Left 2
WINDOW 3 61 68 Left 2
SYMATTR InstName Q33
SYMATTR Value BC857B
SYMBOL npn -4336 16224 M0
SYMATTR InstName Q34
SYMATTR Value BC847B
SYMBOL npn -4560 16432 R0
SYMATTR InstName Q35
SYMATTR Value BC847B
SYMBOL npn -4656 16224 R0
SYMATTR InstName Q36
SYMATTR Value BC847B
SYMBOL Res -4512 16544 R0
SYMATTR InstName R8
SYMATTR Value 100
SYMBOL pnp -4528 15904 R180
WINDOW 0 60 32 Left 2
WINDOW 3 58 66 Left 2
SYMATTR InstName Q37
SYMATTR Value BC857B
SYMBOL pnp -4464 15904 M180
WINDOW 0 64 34 Left 2
WINDOW 3 61 68 Left 2
SYMATTR InstName Q38
SYMATTR Value BC857B
SYMBOL pnp -4528 16064 R180
WINDOW 0 60 32 Left 2
WINDOW 3 58 66 Left 2
SYMATTR InstName Q39
SYMATTR Value BC857B
SYMBOL pnp -4464 16064 M180
WINDOW 0 64 34 Left 2
WINDOW 3 61 68 Left 2
SYMATTR InstName Q40
SYMATTR Value BC857B
SYMBOL Cap -5408 16416 R0
SYMATTR InstName C2
SYMATTR Value 1000p
SYMBOL Cap -6400 16480 R0
SYMATTR InstName C4
SYMATTR Value 1000p
SYMBOL Cap -6464 16160 R90
WINDOW 0 0 32 VBottom 2
WINDOW 3 32 32 VTop 2
SYMATTR InstName C5
SYMATTR Value 1000p
SYMBOL Voltage -6784 16240 R0
SYMATTR InstName V5
SYMATTR Value SINE(0 30m 500k)
SYMBOL Res -6496 16432 R0
SYMATTR InstName R9
SYMATTR Value 1k
SYMBOL npn -4752 16224 M0
SYMATTR InstName Q41
SYMATTR Value BC847B
SYMBOL npn -4976 16432 R0
SYMATTR InstName Q43
SYMATTR Value BC847B
SYMBOL npn -5072 16224 R0
SYMATTR InstName Q45
SYMATTR Value BC847B
SYMBOL Res -4928 16544 R0
SYMATTR InstName R11
SYMATTR Value 100
SYMBOL npn -5968 16224 M0
SYMATTR InstName Q46
SYMATTR Value BC847B
SYMBOL npn -6192 16432 R0
SYMATTR InstName Q47
SYMATTR Value BC847B
SYMBOL npn -6288 16224 R0
SYMATTR InstName Q48
SYMATTR Value BC847B
SYMBOL Res -6144 16544 R0
SYMATTR InstName R12
SYMATTR Value 100
SYMBOL npn -5552 16432 R0
SYMATTR InstName Q49
SYMATTR Value BC847B
SYMBOL Res -5504 16544 R0
SYMATTR InstName R13
SYMATTR Value 100
SYMBOL npn -4352 16432 R0
SYMATTR InstName Q50
SYMATTR Value BC847B
SYMBOL Res -4304 16544 R0
SYMATTR InstName R14
SYMATTR Value 100
SYMBOL npn -5968 16432 R0
SYMATTR InstName Q51
SYMATTR Value BC847B
SYMBOL Res -5920 16544 R0
SYMATTR InstName R19
SYMATTR Value 100
SYMBOL npn -4912 17328 M0
SYMATTR InstName Q56
SYMATTR Value BC847B
SYMBOL npn -5136 17536 R0
SYMATTR InstName Q57
SYMATTR Value BC847B
SYMBOL npn -5232 17328 R0
SYMATTR InstName Q58
SYMATTR Value BC847B
SYMBOL Res -4832 17312 R0
SYMATTR InstName R20
SYMATTR Value 330
SYMBOL Res -5088 17648 R0
SYMATTR InstName R21
SYMATTR Value 100
SYMBOL Res -4832 17536 R0
SYMATTR InstName R22
SYMATTR Value 3
SYMBOL pnp -5104 17040 R180
WINDOW 0 60 32 Left 2
WINDOW 3 58 66 Left 2
SYMATTR InstName Q59
SYMATTR Value BC857B
SYMBOL pnp -5040 17040 M180
WINDOW 0 64 34 Left 2
WINDOW 3 61 68 Left 2
SYMATTR InstName Q60
SYMATTR Value BC857B
SYMBOL pnp -5104 17200 R180
WINDOW 0 60 32 Left 2
WINDOW 3 58 66 Left 2
SYMATTR InstName Q61
SYMATTR Value BC857B
SYMBOL pnp -5040 17200 M180
WINDOW 0 64 34 Left 2
WINDOW 3 61 68 Left 2
SYMATTR InstName Q62
SYMATTR Value BC857B
SYMBOL MCP6021 -4544 17264 R0
SYMATTR InstName U2
SYMBOL npn -5344 17328 M0
SYMATTR InstName Q63
SYMATTR Value BC847B
SYMBOL npn -5568 17536 R0
SYMATTR InstName Q64
SYMATTR Value BC847B
SYMBOL npn -5664 17328 R0
SYMATTR InstName Q65
SYMATTR Value BC847B
SYMBOL Res -5520 17648 R0
SYMATTR InstName R10
SYMATTR Value 100
SYMBOL npn -4752 16432 R0
SYMATTR InstName Q66
SYMATTR Value BC847B
SYMBOL Res -4704 16544 R0
SYMATTR InstName R23
SYMATTR Value 100
TEXT -440 13760 Left 2 !.tran 0 12m 100u 5n
TEXT 408 13712 Left 4 ;Wide frequency range VCO for Theremin AFE
TEXT 2832 14048 Left 2 !.ic V(RC1)=2.251\n.ic V(RC2)=2.252\n.ic V(INT1)=2.82
TEXT 2800 13984 Left 4 ;Amplitude limiter
TEXT 2504 14256 Left 3 ;Unity gain output buffer - operational amplifier with current feedback
TEXT -6720 14680 Left 4 ;Inverting amplifier\namplitude limiter
TEXT -4744 14472 Left 2 !.ic V(RR1)=2.2503\n.ic V(RR2)=2.25

The netlist it stands for:
* vco_sine_bjt_v11.asc
V1 COM 0 4.5
V2 VREF 0 2.25
V19 VCC33 0 3.3
V4 VREF12 0 1.2
Q52 N003 VCOBIAS1 N005 0 BC847B
R60 COM VCOBIAS2 22k
R1 COM VCOBIAS3 4.7k
I1 COM N003 PWL(0 30u 500u 30u 8m 800u)
Q54 VCOBIAS2 VCOBIAS2 N022 0 BC847B
Q55 VCOBIAS3 VCOBIAS3 N039 0 BC847B
Q53 COM N003 VCOBIAS1 0 BC847B
R15 N005 0 100
R16 N039 0 100
R17 N022 0 100
C1 NC_01 0 1n
R40 COM VCOBIAS22 22k
Q125 VCOBIAS22 VCOBIAS22 N021 0 BC847B
R41 N021 0 100
L1 DRIVE ANT 2mH Rser=120 Cpar=1pF
C_ant1 ANT 0 10pF
R66 VCOOUT DRIVE 4.7
Q42 N078 VCOBIAS0 N079 0 BC847B
I2 COM N078 400µ
Q44 COM N078 VCOBIAS0 0 BC847B
R18 N079 0 100
C3 NC_02 0 1n
Q157 RR2 RR2 N030 0 BC847B
Q158 N030 VCOBIAS1 N038 0 BC847B
Q159 N017 BPBUF N030 0 BC847B
R50 N038 0 100
Q164 RR1 RR1 N029 0 BC847B
Q165 N029 VCOBIAS1 N037 0 BC847B
Q166 N016 BPLIM N029 0 BC847B
R51 N037 0 100
C16 BPBUF RR1 240p
C17 RR2 RR1 1200p
Q171 BPLIM BPFB N028 0 BC847B
Q172 N028 VCOBIAS2 N036 0 BC847B
Q173 N015 VREF N028 0 BC847B
R52 BPLIM N031 390
R53 N036 0 100
Q174 N020 N025 N027 0 BC847B
Q175 N027 VCOBIAS1 N035 0 BC847B
Q176 N019 VREF N027 0 BC847B
R54 N035 0 100
R55 N031 VREF 1
XU5 VREF N060 COM 0 N047 MCP6021  ; pins In+ In- V+ V- OUT
C18 N047 N059 150p
C19 N060 N059 1100p
R56 N047 N060 620
R57 NC_03 VREF 510
R58 N059 N058 250
V3 N058 VREF SINE(0 0.04 1000k)
Q1 N018 N023 N026 0 BC847B
Q2 N026 VCOBIAS1 N032 0 BC847B
Q3 N011 VREF N026 0 BC847B
R2 N032 0 100
Q4 N010 N006 COM 0 BC857B
Q5 N006 N006 COM 0 BC857B
Q6 N011 N011 N010 0 BC857B
Q7 N018 N011 N006 0 BC857B
Q8 N024 VCOBIAS1 N033 0 BC847B
R3 N033 0 100
Q9 COM N018 N024 0 BC847B
Q10 N024 VCOBIAS1 N034 0 BC847B
R4 N034 0 100
XU1 VREF RR2 COM 0 BPBUF MCP6021  ; pins In+ In- V+ V- OUT
R5 NC_04 VREF 200
R6 BPBUF BPFB 1
Q11 N002 N001 COM 0 BC857B
Q12 N001 N001 COM 0 BC857B
Q13 N004 N004 N002 0 BC857B
Q14 NC_05 N004 N001 0 BC857B
Q15 N012 N007 COM 0 BC857B
Q16 N007 N007 COM 0 BC857B
Q17 N015 N015 N012 0 BC857B
Q18 BPLIM N015 N007 0 BC857B
Q19 N013 N008 COM 0 BC857B
Q20 N008 N008 COM 0 BC857B
Q21 N016 N016 N013 0 BC857B
Q22 RR1 N016 N008 0 BC857B
Q23 N014 N009 COM 0 BC857B
Q24 N009 N009 COM 0 BC857B
Q25 N017 N017 N014 0 BC857B
Q26 RR2 N017 N009 0 BC857B
Q27 N046 VREF N052 0 BC847B
Q28 N052 VCOBIAS1 N063 0 BC847B
Q29 N044 N049 N052 0 BC847B
R7 N063 0 100
Q30 N042 N040 COM 0 BC857B
Q31 N040 N040 COM 0 BC857B
Q32 N044 N044 N042 0 BC857B
Q33 N046 N044 N040 0 BC857B
Q34 N049 N046 N054 0 BC847B
Q35 N054 VCOBIAS1 N067 0 BC847B
Q36 N045 VREF N054 0 BC847B
R8 N067 0 100
Q37 N043 N041 COM 0 BC857B
Q38 N041 N041 COM 0 BC857B
Q39 N045 N045 N043 0 BC857B
Q40 N049 N045 N041 0 BC857B
C2 N046 VREF 1000p
C4 N049 VREF 1000p
C5 N049 N048 1000p
V5 N050 VREF SINE(0 30m 500k)
R9 N057 VREF 1k
Q41 N049 N049 N053 0 BC847B
Q43 N053 VCOBIAS1 N065 0 BC847B
Q45 N045 VREF N053 0 BC847B
R11 N065 0 100
Q46 N046 N046 N051 0 BC847B
Q47 N051 VCOBIAS1 N061 0 BC847B
Q48 N044 VREF N051 0 BC847B
R12 N061 0 100
Q49 N052 VCOBIAS1 N064 0 BC847B
R13 N064 0 100
Q50 N056 VCOBIAS1 N068 0 BC847B
R14 N068 0 100
Q51 N052 VCOBIAS1 N062 0 BC847B
R19 N062 0 100
Q56 N072 N073 N075 0 BC847B
Q57 N075 VCOBIAS2 N077 0 BC847B
Q58 N071 N046 N075 0 BC847B
R20 N072 N073 330
R21 N077 0 100
R22 N073 VREF 3
Q59 N070 N069 COM 0 BC857B
Q60 N069 N069 COM 0 BC857B
Q61 N071 N071 N070 0 BC857B
Q62 N072 N071 N069 0 BC857B
XU2 N072 N048 COM 0 N048 MCP6021  ; pins In+ In- V+ V- OUT
Q63 N072 N073 N074 0 BC847B
Q64 N074 VCOBIAS1 N076 0 BC847B
Q65 N071 VREF N074 0 BC847B
R10 N076 0 100
Q66 N055 VCOBIAS1 N066 0 BC847B
R23 N066 0 100
.model NPN NPN
.model PNP PNP
.lib standard.bjt
.tran 0 12m 100u 5n
* Wide frequency range VCO for Theremin AFE
.ic V(RC1)=2.251
.ic V(RC2)=2.252
.ic V(INT1)=2.82
* Amplitude limiter
* Unity gain output buffer - operational amplifier with current feedback
* Inverting amplifier
* amplitude limiter
.ic V(RR1)=2.2503
.ic V(RR2)=2.25
.lib MCP6021.cir
.backanno
.end